# EAGLE design tinyha_doorbell (EAGLE 7.7.0)
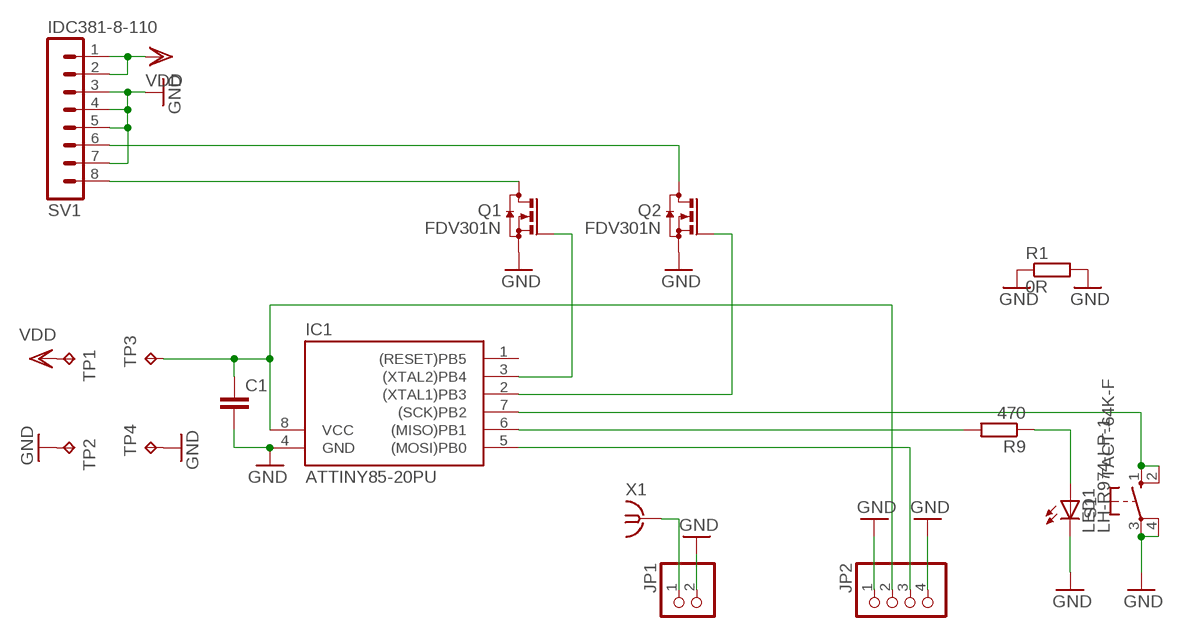
[diagram p0: schematic, sheet 1]

## Parts
C1  C-EUC0805K  [C0805K]
IC1  ATTINY85-20PU  TINY12P  [DIL08]
JP1  PINHD-1X2  [1X02]
JP2  PINHD-1X4  [1X04]
LED1  LH-R974-LP-1  LED3MM  [LED3MM]
Q1  FDV301N  BSS123  [SOT23]
Q2  FDV301N  BSS123  [SOT23]
R1  0R  R-EU_R1206  [R1206]
R9  470  R-EU_R0805  [R0805]
S1  TACT-64K-F  10-XX  [B3F-10XX]
SV1  IDC381-8-110  MA08-1-IDC  [IDC381-8]
TP1  TPPAD1-13Y  [P1-13Y]
TP2  TPPAD1-13Y  [P1-13Y]
TP3  TPPAD1-13Y  [P1-13Y]
TP4  TPPAD1-13Y  [P1-13Y]
X1  SMA-DX-V  [BU-SMA-V]

## Nets
GND: C1.2 IC1.4(GND) JP1.2 JP2.1 JP2.4 LED1.K(C) Q1.2(S) Q2.2(S) R1.1 R1.2 S1.3(P) S1.4(P1) SV1.3 SV1.4 SV1.5 SV1.7 TP2.TP TP4.TP
N$1: JP1.1 X1.1
N$2: IC1.7((SCK)PB2) S1.1(S) S1.2(S1)
N$3: IC1.5((MOSI)PB0) JP2.3
N$4: IC1.6((MISO)PB1) R9.2
N$5: IC1.3((XTAL2)PB4) Q1.1(G)
N$6: C1.1 IC1.8(VCC) JP2.2 TP3.TP
N$7: IC1.2((XTAL1)PB3) Q2.1(G)
N$18: Q2.3(D) SV1.6
N$23: Q1.3(D) SV1.8
N$104: LED1.A R9.1
VDD: SV1.1 SV1.2 TP1.TP
Unconnected: IC1.1((RESET)PB5)

## Power pins joined to a net without a drawn wire
GND: X1.2@1 X1.2@2 X1.2@3 X1.2@4

## Library data of the parts
C1 = rcl:C-EU: CAPACITOR, European symbol
IC1 = atmel:TINY12*: MICROCONTROLLER 1 Kbytes FLASH 64 bytes EEPROM; OC_FARNELL: unknown; OC_NEWARK: unknown
JP1 = pinhead:PINHD-1X2: PIN HEADER
JP2 = pinhead:PINHD-1X4: PIN HEADER
LED1 = led:LED: LED OSRAM: - CHIPLED LG R971, LG N971, LY N971, LG Q971, LY Q971, LO R971, LY R971 LH N974, LH R974 LS Q976, LO Q976, LY Q976 LO Q996 - Hyper CHIPLED LW Q18S LB Q993, LB Q99A, LB R99A - SideLED LS A670, LO A670, LY A670, LG A670, LP A670 LB A673, LV A673, LT A673, LW A673 LH A674 LY A675 LS A676, LA A676, LO A676, LY A676, LW A676 LS A679, LY A679, LG A679 - Hyper Micro SIDELED® LS Y876, LA Y876, LO Y876, LY Y876 LT Y87S - SmartLED LW L88C, LW L88S LB L89C, LB L89S, LG L890 LS L89K, LO L89K, LY L89K LS L896, LA L896, LO L896, LY L896 - TOPLED LS T670, LO T670, LY T670, LG T670, LP T670 LSG T670, LSP T670, LSY T670, LOP T670, LYG T670 LG T671, LOG T671, LSG T671 LB T673, LV T673, LT T673, LW T673 LH T674 LS T676, LA T676, LO T676, LY T676, LB T676, LH T676, LSB T676, LW T676 LB T67C, LV T67C, LT T67C, LS T67K, LO T67K, LY T67K, LW E67C LS E67B, LA E67B, LO E67B, LY E67B, LB E67C, LV E67C, LT E67C LW T67C LS T679, LY T679, LG T679 LS T770, LO T770, LY T770, LG T770, LP T770 LB T773, LV T773, LT T773, LW T773 LH T774 LS E675, LA E675, LY E675, LS T675 LS T776, LA T776, LO T776, LY T776, LB T776 LHGB T686 LT T68C, LB T68C - Hyper Mini TOPLED® LB M676 - Mini TOPLED Santana® LG M470 LS M47K, LO M47K, LY M47K Source: http://www.osram.convergy.de LUXEON: - LUMILED® LXK2-PW12-R00, LXK2-PW12-S00, LXK2-PW14-U00, LXK2-PW14-V00 LXK2-PM12-R00, LXK2-PM12-S00, LXK2-PM14-U00 LXK2-PE12-Q00, LXK2-PE12-R00, LXK2-PE12-S00, LXK2-PE14-T00, LXK2-PE14-U00 LXK2-PB12-K00, LXK2-PB12-L00, LXK2-PB12-M00, LXK2-PB14-N00, LXK2-PB14-P00, LXK2-PB14-Q00 LXK2-PR12-L00, LXK2-PR12-M00, LXK2-PR14-Q00, LXK2-PR14-R00 LXK2-PD12-Q00, LXK2-PD12-R00, LXK2-PD12-S00 LXK2-PH12-R00, LXK2-PH12-S00 LXK2-PL12-P00, LXK2-PL12-Q00, LXK2-PL12-R00 Source: www.luxeon.com KINGBRIGHT: KA-3528ASYC Source: www.kingbright.com
Q1 Q2 = transistor-small-signal:BSS123: N-CHANNEL MOS FET
R1 R9 = rcl:R-EU_: RESISTOR, European symbol
S1 = switch-omron:10-XX: OMRON SWITCH; MPN: B3F-1000; OC_FARNELL: 176432; OC_NEWARK: 36M3542
SV1 = custom:MA08-1: PIN HEADER
TP1-TP4 = testpad:TP: Test pad
X1 = alpov:SMA-DX: FEMALE SMA CONNECTOR Radiall distributor RS 112-3794

## Board
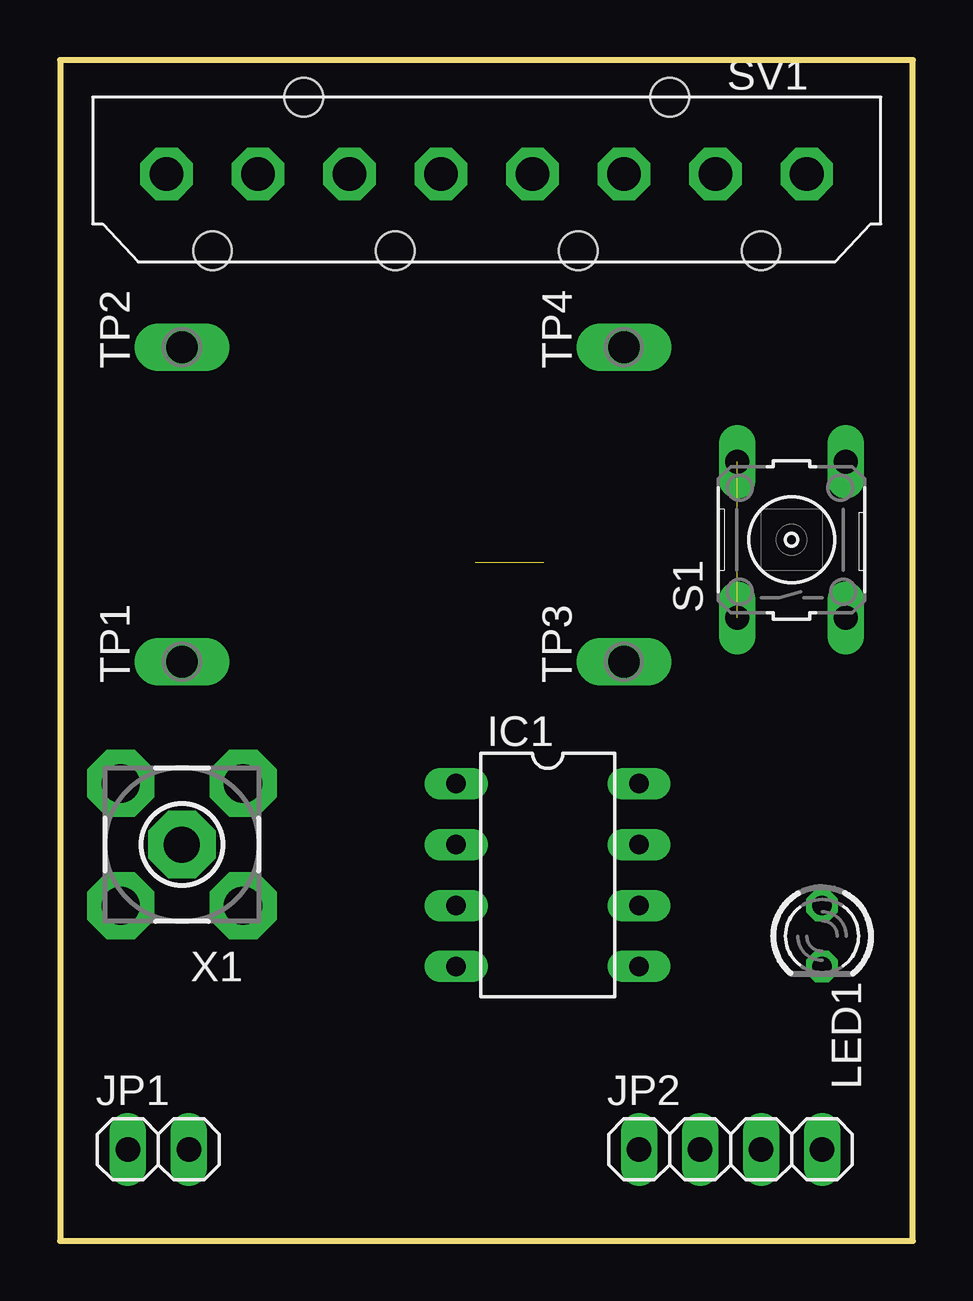
[diagram p1: board, top side]
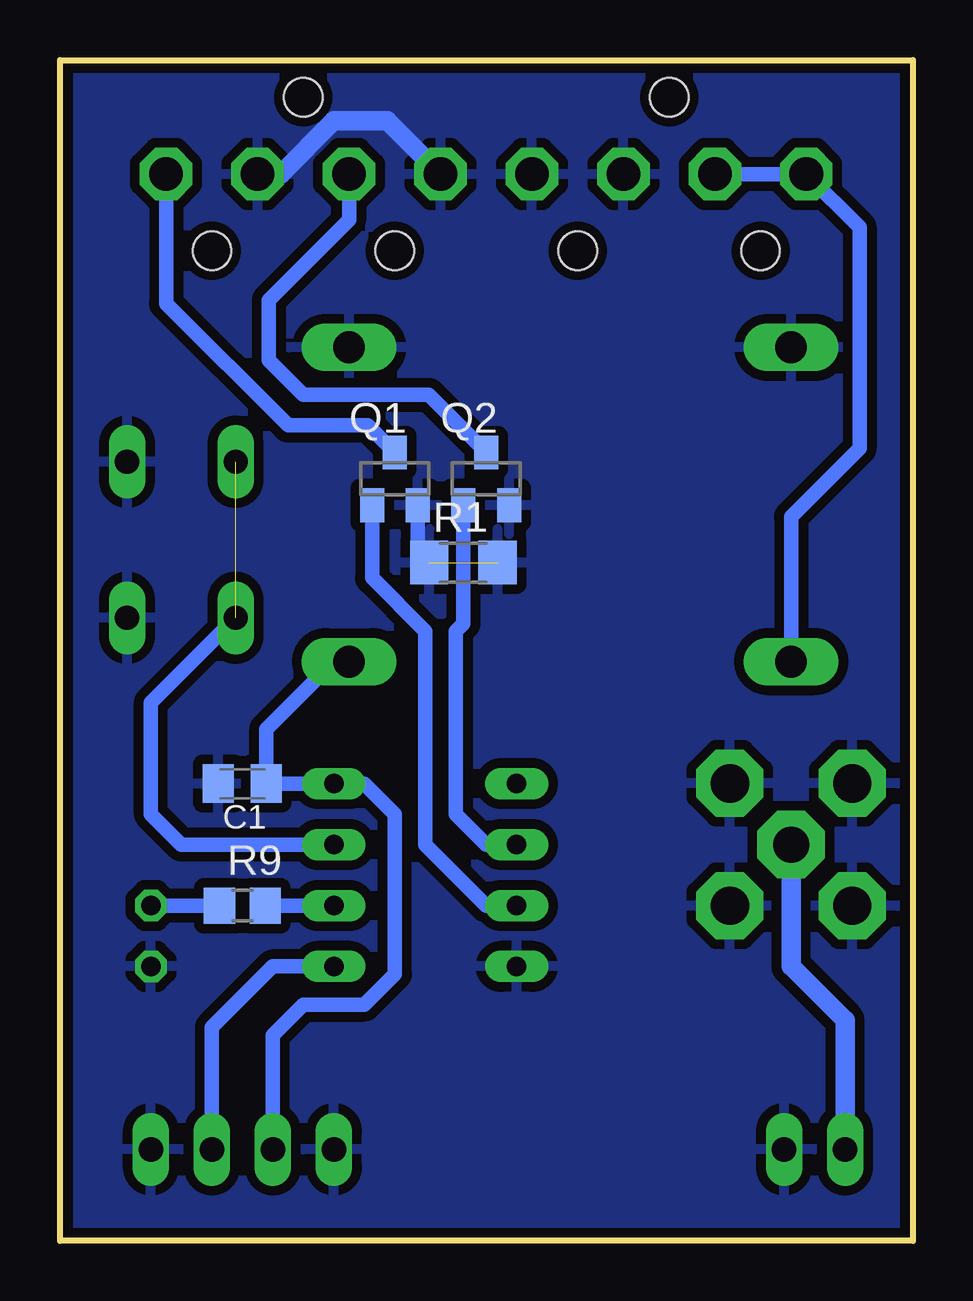
[diagram p2: board, bottom side, seen from below]

Size 35.54 x 49.2 mm. Coordinates in mm from the lower left corner, seen from the top.
Outline: 0,0 35.54,0 35.54,49.2 0,49.2 0,0
Copper layers (1*16): Top 0.035mm / dielectric 1.5mm / Bottom 0.035mm
Design rules "default *": minimum track width 10mil, minimum drill 24mil, track to track 8mil, track to pad 8mil, pad to pad 8mil, via to via 8mil, smd to smd 8mil, copper to edge 10mil, drill to drill 8mil, minimum pad ring 10mil, minimum via ring 8mil, stop-mask expansion 4mil, vias tented up to drill 0mil, thermal gap 16mil
tRestrict: area 2.5,21.6 to 26.2,39.7; area 1.3,1.3 to 33,8.9

### Footprints (pad centres in the part's own frame; a part is rotated, then mirrored left to right if it is on the bottom)
C0805K = smd 1.3 x 1.6: 1 -1,0; 2 1,0
DIL08 = drill 0.813 long: 1 -3.81,-3.81; 2 -1.27,-3.81; 3 1.27,-3.81; 4 3.81,-3.81; 5 3.81,3.81; 6 1.27,3.81; 7 -1.27,3.81; 8 -3.81,3.81
1X02 = drill 1.016 long: 1 -1.27,0; 2 1.27,0
1X04 = drill 1.016 long: 1 -3.81,0; 2 -1.27,0; 3 1.27,0; 4 3.81,0
LED3MM = drill 0.813 octagon: A -1.27,0; K 1.27,0
SOT23 = smd 1 x 1.4: 1 -0.95,-1.1; 2 0.95,-1.1; 3 0,1.1
R1206 = smd 1.6 x 1.803: 1 -1.422,0; 2 1.422,0
R0805 = smd 1.3 x 1.5: 1 -0.95,0; 2 0.95,0
B3F-10XX = drill 1.016 long: 1 -3.251,2.261; 2 3.251,2.261; 3 -3.251,-2.261; 4 3.251,-2.261
IDC381-8 = drill 1.4 pad 2.184 octagon: 1 -13.335,0; 2 -9.525,0; 3 -5.715,0; 4 -1.905,0; 5 1.905,0; 6 5.715,0; 7 9.525,0; 8 13.335,0 | hole 1.6: -11.43,-3.2; -3.81,-3.2; 3.81,-3.2; 11.43,-3.2; -7.62,3.2; 7.62,3.2
P1-13Y = drill 1.321 pad 1.905 long: TP 0,0
BU-SMA-V = drill 1.5 pad 2.8 octagon: 1 0,0 | drill 1.6 pad 2.8 octagon: 2@1 -2.55,2.55; 2@2 2.55,2.55; 2@3 -2.55,-2.55; 2@4 2.55,-2.55

### Placement (x,y rotation side)
C1  27.94,19.05 180 bottom
IC1  20.32,15.24 270 top
JP1  4.1,3.81 0 top
JP2  27.94,3.81 0 top
LED1  31.75,12.7 270 top
Q1  21.59,31.75 0 bottom
Q2  17.78,31.75 0 bottom
R1  18.73,28.26 0 bottom
R9  27.94,13.97 0 bottom
S1  30.48,29.21 90 top
SV1  17.78,44.45 0 top
TP1  5.08,24.13 90 top
TP2  5.08,37.23 90 top
TP3  23.5,24.13 90 top
TP4  23.5,37.23 90 top
X1  5.08,16.51 180 top

### Tracks (layer width: path | path; a pad name or v marks a point on that pad's centre or on a via)
GND  (1 unrouted)
  Bottom 0.61: Q1.2 20.64,28.74 R1.1
  Bottom 0.813: SV1.7 26.35,44.45 24.13,46.67 21.91,46.67 SV1.5
  pour Bottom (isolate 0.406): 0,49.53 35.56,49.53 35.56,0 0,0
N$1
  Bottom 0.813: JP1.1 2.83,9.18 5.08,11.43 X1.1
N$2  (1 unrouted)
  Bottom 0.61: IC1.7 30.48,16.51 31.75,17.78 31.75,22.43 S1.1
N$3
  Bottom 0.61: IC1.5 26.67,11.43 29.21,8.89 JP2.3
N$4
  Bottom 0.61: IC1.6 R9.2
N$5
  Bottom 0.61: IC1.3 17.78,13.97 20.32,16.51 20.32,25.4 22.54,27.62 Q1.1
N$6
  Bottom 0.61: 24.13,24.13 26.94,21.32 C1.1 IC1.8 22.86,19.05 21.59,17.78 21.59,11.11 22.86,9.84 25.4,9.84 26.67,8.57 JP2.2
  Bottom 0.813: TP3.TP 24.13,24.13
N$7
  Bottom 0.61: Q2.1 18.73,25.72 19.05,25.4 19.05,17.78 17.78,16.51 IC1.2
N$18
  Bottom 0.61: SV1.6 23.5,42.55 26.84,39.2 26.84,36.68 25.4,35.24 20.17,35.24 Q2.3
N$23
  Bottom 0.61: SV1.8 31.11,39.05 26.04,33.97 22.71,33.97 Q1.3
N$104
  Bottom 0.61: R9.1 LED1.A
VDD
  Bottom 0.61: SV1.2 SV1.1 2.22,42.23 2.22,33.02 5.08,30.16 TP1.TP